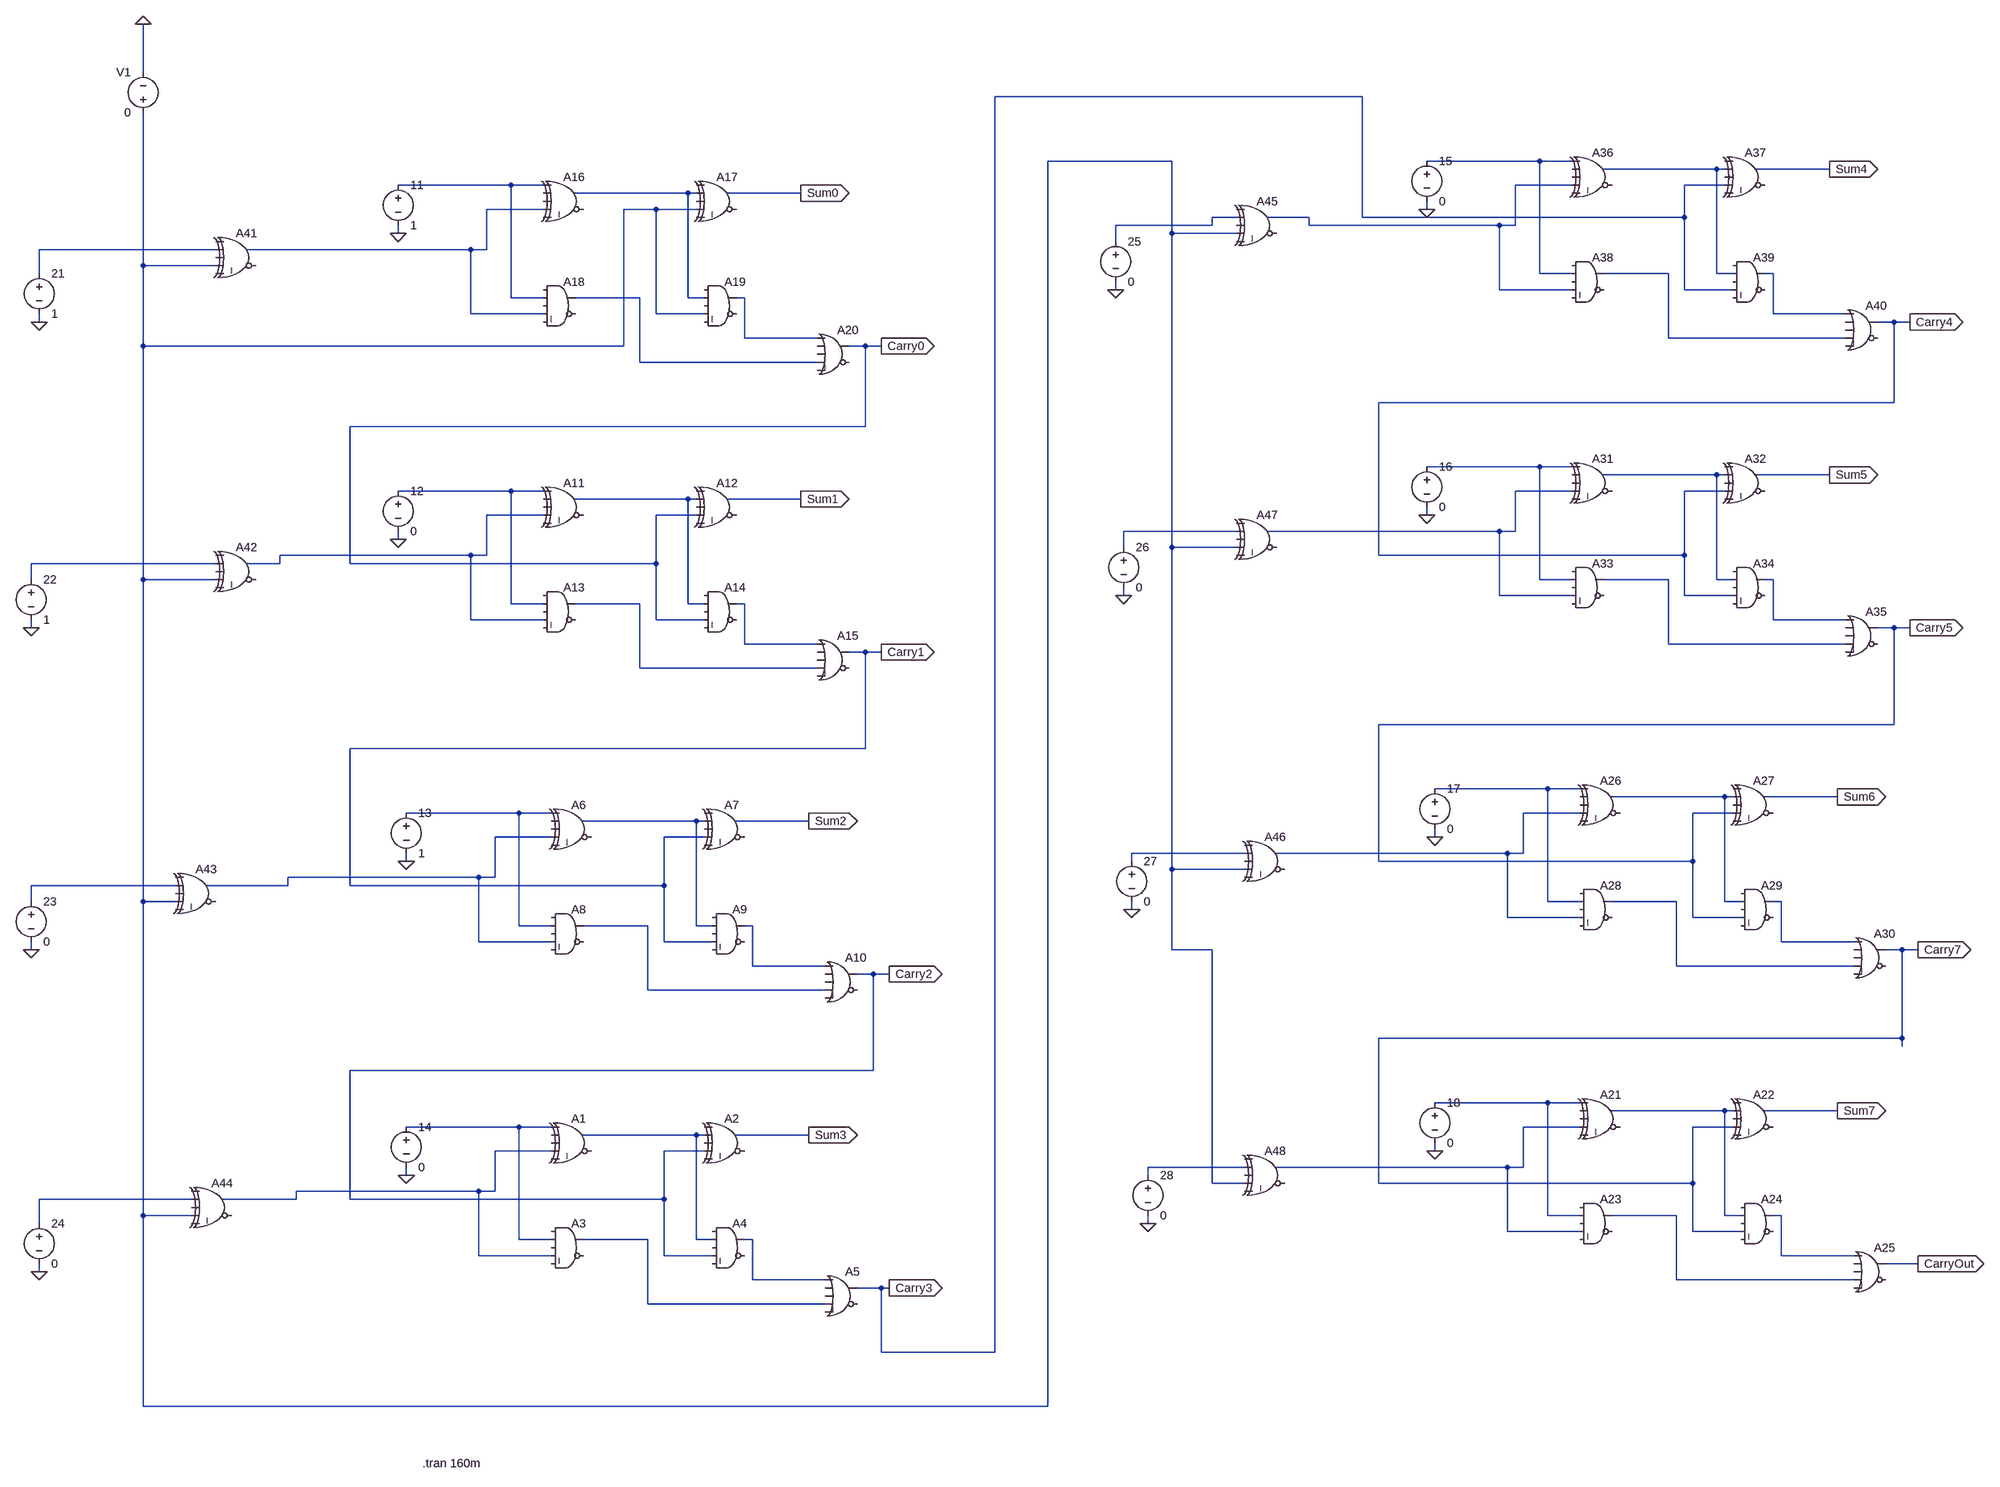
[diagram p0: schematic 8-bit-ADD-SUBRACT.asc]
8-bit-ADD-SUBRACT.asc, the LTspice schematic file:
Version 4.1
SHEET 1 3140 680
WIRE -1056 -2944 -1056 -3040
WIRE 1872 -2896 1072 -2896
WIRE 1472 -2768 1200 -2768
WIRE 2224 -2768 2000 -2768
WIRE 2288 -2768 2224 -2768
WIRE 2576 -2752 2352 -2752
WIRE 2592 -2752 2576 -2752
WIRE 2800 -2752 2656 -2752
WIRE -320 -2720 -544 -2720
WIRE -256 -2720 -320 -2720
WIRE 2288 -2720 2176 -2720
WIRE 2592 -2720 2512 -2720
WIRE 32 -2704 -192 -2704
WIRE 48 -2704 32 -2704
WIRE 256 -2704 112 -2704
WIRE -256 -2672 -368 -2672
WIRE -32 -2672 -96 -2672
WIRE 48 -2672 -32 -2672
WIRE 2000 -2672 2000 -2688
WIRE 1600 -2656 1552 -2656
WIRE 1744 -2656 1664 -2656
WIRE 1872 -2656 1872 -2896
WIRE 2512 -2656 2512 -2720
WIRE 2512 -2656 1872 -2656
WIRE 1552 -2640 1552 -2656
WIRE 1552 -2640 1360 -2640
WIRE 1744 -2640 1744 -2656
WIRE 2144 -2640 1744 -2640
WIRE 2176 -2640 2176 -2720
WIRE 2176 -2640 2144 -2640
WIRE -544 -2624 -544 -2640
WIRE 1472 -2624 1472 -2768
WIRE 1600 -2624 1472 -2624
WIRE 1360 -2608 1360 -2640
WIRE -912 -2592 -1264 -2592
WIRE -400 -2592 -848 -2592
WIRE -368 -2592 -368 -2672
WIRE -368 -2592 -400 -2592
WIRE -1056 -2560 -1056 -2864
WIRE -912 -2560 -1056 -2560
WIRE -1264 -2544 -1264 -2592
WIRE 2224 -2544 2224 -2768
WIRE 2288 -2544 2224 -2544
WIRE 2480 -2544 2352 -2544
WIRE 2576 -2544 2576 -2752
WIRE 2608 -2544 2576 -2544
WIRE 2688 -2544 2672 -2544
WIRE 1360 -2512 1360 -2528
WIRE 2144 -2512 2144 -2640
WIRE 2288 -2512 2144 -2512
WIRE 2512 -2512 2512 -2656
WIRE 2608 -2512 2512 -2512
WIRE -320 -2496 -320 -2720
WIRE -256 -2496 -320 -2496
WIRE -64 -2496 -192 -2496
WIRE 32 -2496 32 -2704
WIRE 64 -2496 32 -2496
WIRE 144 -2496 128 -2496
WIRE -400 -2464 -400 -2592
WIRE -256 -2464 -400 -2464
WIRE -32 -2464 -32 -2672
WIRE 64 -2464 -32 -2464
WIRE 2688 -2464 2688 -2544
WIRE 2832 -2464 2688 -2464
WIRE -1264 -2448 -1264 -2464
WIRE 2928 -2448 2896 -2448
WIRE 2960 -2448 2928 -2448
WIRE 144 -2416 144 -2496
WIRE 288 -2416 144 -2416
WIRE 2480 -2416 2480 -2544
WIRE 2832 -2416 2480 -2416
WIRE -1056 -2400 -1056 -2560
WIRE -96 -2400 -96 -2672
WIRE -96 -2400 -1056 -2400
WIRE 384 -2400 352 -2400
WIRE 416 -2400 384 -2400
WIRE -64 -2368 -64 -2496
WIRE 288 -2368 -64 -2368
WIRE 2928 -2288 2928 -2448
WIRE 2928 -2288 1904 -2288
WIRE 384 -2240 384 -2400
WIRE 384 -2240 -640 -2240
WIRE 2224 -2160 2000 -2160
WIRE 2288 -2160 2224 -2160
WIRE 2576 -2144 2352 -2144
WIRE 2592 -2144 2576 -2144
WIRE 2800 -2144 2656 -2144
WIRE -320 -2112 -544 -2112
WIRE -256 -2112 -320 -2112
WIRE 2288 -2112 2176 -2112
WIRE 2592 -2112 2512 -2112
WIRE 32 -2096 -192 -2096
WIRE 48 -2096 32 -2096
WIRE 256 -2096 112 -2096
WIRE -256 -2064 -368 -2064
WIRE 48 -2064 -32 -2064
WIRE 2000 -2064 2000 -2080
WIRE 1600 -2032 1376 -2032
WIRE 2144 -2032 1664 -2032
WIRE 2176 -2032 2176 -2112
WIRE 2176 -2032 2144 -2032
WIRE -544 -2016 -544 -2032
WIRE 1376 -2000 1376 -2032
WIRE 1472 -2000 1472 -2624
WIRE 1600 -2000 1472 -2000
WIRE -400 -1984 -784 -1984
WIRE -368 -1984 -368 -2064
WIRE -368 -1984 -400 -1984
WIRE 1904 -1984 1904 -2288
WIRE 2512 -1984 2512 -2112
WIRE 2512 -1984 1904 -1984
WIRE -912 -1968 -1280 -1968
WIRE -784 -1968 -784 -1984
WIRE -784 -1968 -848 -1968
WIRE -640 -1968 -640 -2240
WIRE -32 -1968 -32 -2064
WIRE -32 -1968 -640 -1968
WIRE -1280 -1936 -1280 -1968
WIRE -1056 -1936 -1056 -2400
WIRE -912 -1936 -1056 -1936
WIRE 2224 -1936 2224 -2160
WIRE 2288 -1936 2224 -1936
WIRE 2480 -1936 2352 -1936
WIRE 2576 -1936 2576 -2144
WIRE 2608 -1936 2576 -1936
WIRE 2688 -1936 2672 -1936
WIRE 1376 -1904 1376 -1920
WIRE 2144 -1904 2144 -2032
WIRE 2288 -1904 2144 -1904
WIRE 2512 -1904 2512 -1984
WIRE 2608 -1904 2512 -1904
WIRE -320 -1888 -320 -2112
WIRE -256 -1888 -320 -1888
WIRE -64 -1888 -192 -1888
WIRE 32 -1888 32 -2096
WIRE 64 -1888 32 -1888
WIRE 144 -1888 128 -1888
WIRE -400 -1856 -400 -1984
WIRE -256 -1856 -400 -1856
WIRE -32 -1856 -32 -1968
WIRE 64 -1856 -32 -1856
WIRE 2688 -1856 2688 -1936
WIRE 2832 -1856 2688 -1856
WIRE -1280 -1840 -1280 -1856
WIRE 2928 -1840 2896 -1840
WIRE 2960 -1840 2928 -1840
WIRE 144 -1808 144 -1888
WIRE 288 -1808 144 -1808
WIRE 2480 -1808 2480 -1936
WIRE 2832 -1808 2480 -1808
WIRE 384 -1792 352 -1792
WIRE 416 -1792 384 -1792
WIRE -64 -1760 -64 -1888
WIRE 288 -1760 -64 -1760
WIRE 2928 -1648 2928 -1840
WIRE 2928 -1648 1904 -1648
WIRE 384 -1600 384 -1792
WIRE 384 -1600 -640 -1600
WIRE 2240 -1520 2016 -1520
WIRE 2304 -1520 2240 -1520
WIRE 2592 -1504 2368 -1504
WIRE 2608 -1504 2592 -1504
WIRE 2816 -1504 2672 -1504
WIRE -304 -1472 -528 -1472
WIRE -240 -1472 -304 -1472
WIRE 2304 -1472 2192 -1472
WIRE 2608 -1472 2528 -1472
WIRE 48 -1456 -176 -1456
WIRE 64 -1456 48 -1456
WIRE 272 -1456 128 -1456
WIRE -240 -1424 -352 -1424
WIRE 64 -1424 -16 -1424
WIRE 2016 -1424 2016 -1440
WIRE 1616 -1392 1392 -1392
WIRE 2160 -1392 1680 -1392
WIRE 2192 -1392 2192 -1472
WIRE 2192 -1392 2160 -1392
WIRE -528 -1376 -528 -1392
WIRE 1392 -1376 1392 -1392
WIRE 1904 -1376 1904 -1648
WIRE 2528 -1376 2528 -1472
WIRE 2528 -1376 1904 -1376
WIRE 1472 -1360 1472 -2000
WIRE 1616 -1360 1472 -1360
WIRE -384 -1344 -768 -1344
WIRE -352 -1344 -352 -1424
WIRE -352 -1344 -384 -1344
WIRE -992 -1328 -1280 -1328
WIRE -768 -1328 -768 -1344
WIRE -768 -1328 -928 -1328
WIRE -640 -1328 -640 -1600
WIRE -16 -1328 -16 -1424
WIRE -16 -1328 -640 -1328
WIRE -1280 -1296 -1280 -1328
WIRE -1056 -1296 -1056 -1936
WIRE -992 -1296 -1056 -1296
WIRE 2240 -1296 2240 -1520
WIRE 2304 -1296 2240 -1296
WIRE 2496 -1296 2368 -1296
WIRE 2592 -1296 2592 -1504
WIRE 2624 -1296 2592 -1296
WIRE 2704 -1296 2688 -1296
WIRE 1392 -1280 1392 -1296
WIRE 2160 -1264 2160 -1392
WIRE 2304 -1264 2160 -1264
WIRE 2528 -1264 2528 -1376
WIRE 2624 -1264 2528 -1264
WIRE -304 -1248 -304 -1472
WIRE -240 -1248 -304 -1248
WIRE -48 -1248 -176 -1248
WIRE 48 -1248 48 -1456
WIRE 80 -1248 48 -1248
WIRE 160 -1248 144 -1248
WIRE -384 -1216 -384 -1344
WIRE -240 -1216 -384 -1216
WIRE -16 -1216 -16 -1328
WIRE 80 -1216 -16 -1216
WIRE 2704 -1216 2704 -1296
WIRE 2848 -1216 2704 -1216
WIRE -1280 -1200 -1280 -1216
WIRE 1472 -1200 1472 -1360
WIRE 1552 -1200 1472 -1200
WIRE 2944 -1200 2912 -1200
WIRE 2976 -1200 2944 -1200
WIRE 160 -1168 160 -1248
WIRE 304 -1168 160 -1168
WIRE 2496 -1168 2496 -1296
WIRE 2848 -1168 2496 -1168
WIRE 400 -1152 368 -1152
WIRE 432 -1152 400 -1152
WIRE -48 -1120 -48 -1248
WIRE 304 -1120 -48 -1120
WIRE 2944 -1024 2944 -1200
WIRE 2944 -1024 1904 -1024
WIRE 2944 -1008 2944 -1024
WIRE 400 -960 400 -1152
WIRE 400 -960 -640 -960
WIRE 2240 -896 2016 -896
WIRE 2304 -896 2240 -896
WIRE 2592 -880 2368 -880
WIRE 2608 -880 2592 -880
WIRE 2816 -880 2672 -880
WIRE -304 -848 -528 -848
WIRE -240 -848 -304 -848
WIRE 2304 -848 2192 -848
WIRE 2608 -848 2528 -848
WIRE 48 -832 -176 -832
WIRE 64 -832 48 -832
WIRE 272 -832 128 -832
WIRE -240 -800 -352 -800
WIRE 64 -800 -16 -800
WIRE 2016 -800 2016 -816
WIRE 1616 -768 1424 -768
WIRE 2160 -768 1680 -768
WIRE 2192 -768 2192 -848
WIRE 2192 -768 2160 -768
WIRE -528 -752 -528 -768
WIRE 1424 -752 1424 -768
WIRE 1552 -736 1552 -1200
WIRE 1616 -736 1552 -736
WIRE 1904 -736 1904 -1024
WIRE 2528 -736 2528 -848
WIRE 2528 -736 1904 -736
WIRE -384 -720 -752 -720
WIRE -352 -720 -352 -800
WIRE -352 -720 -384 -720
WIRE -960 -704 -1264 -704
WIRE -752 -704 -752 -720
WIRE -752 -704 -896 -704
WIRE -640 -704 -640 -960
WIRE -16 -704 -16 -800
WIRE -16 -704 -640 -704
WIRE -1056 -672 -1056 -1296
WIRE -960 -672 -1056 -672
WIRE 2240 -672 2240 -896
WIRE 2304 -672 2240 -672
WIRE 2496 -672 2368 -672
WIRE 2592 -672 2592 -880
WIRE 2624 -672 2592 -672
WIRE 2704 -672 2688 -672
WIRE -1264 -656 -1264 -704
WIRE 1424 -656 1424 -672
WIRE 2160 -640 2160 -768
WIRE 2304 -640 2160 -640
WIRE 2528 -640 2528 -736
WIRE 2624 -640 2528 -640
WIRE -304 -624 -304 -848
WIRE -240 -624 -304 -624
WIRE -48 -624 -176 -624
WIRE 48 -624 48 -832
WIRE 80 -624 48 -624
WIRE 160 -624 144 -624
WIRE -384 -592 -384 -720
WIRE -240 -592 -384 -592
WIRE -16 -592 -16 -704
WIRE 80 -592 -16 -592
WIRE 2704 -592 2704 -672
WIRE 2848 -592 2704 -592
WIRE 2976 -576 2912 -576
WIRE -1264 -560 -1264 -576
WIRE 160 -544 160 -624
WIRE 304 -544 160 -544
WIRE 2496 -544 2496 -672
WIRE 2848 -544 2496 -544
WIRE 416 -528 368 -528
WIRE 432 -528 416 -528
WIRE -48 -496 -48 -624
WIRE 304 -496 -48 -496
WIRE 416 -400 416 -528
WIRE 1072 -400 1072 -2896
WIRE 1072 -400 416 -400
WIRE -1056 -288 -1056 -672
WIRE 1200 -288 1200 -2768
WIRE 1200 -288 -1056 -288
FLAG -528 -752 0
FLAG -1264 -560 0
FLAG 272 -832 Sum3
IOPIN 272 -832 Out
FLAG 432 -528 Carry3
IOPIN 432 -528 Out
FLAG -528 -1376 0
FLAG -1280 -1200 0
FLAG 272 -1456 Sum2
IOPIN 272 -1456 Out
FLAG 432 -1152 Carry2
IOPIN 432 -1152 Out
FLAG -544 -2016 0
FLAG -1280 -1840 0
FLAG 256 -2096 Sum1
IOPIN 256 -2096 Out
FLAG 416 -1792 Carry1
IOPIN 416 -1792 Out
FLAG -544 -2624 0
FLAG -1264 -2448 0
FLAG 256 -2704 Sum0
IOPIN 256 -2704 Out
FLAG 416 -2400 Carry0
IOPIN 416 -2400 Out
FLAG 2016 -800 0
FLAG 1424 -656 0
FLAG 2816 -880 Sum7
IOPIN 2816 -880 Out
FLAG 2976 -576 CarryOut
IOPIN 2976 -576 Out
FLAG 2016 -1424 0
FLAG 1392 -1280 0
FLAG 2816 -1504 Sum6
IOPIN 2816 -1504 Out
FLAG 2976 -1200 Carry7
IOPIN 2976 -1200 Out
FLAG 2000 -2064 0
FLAG 1376 -1904 0
FLAG 2800 -2144 Sum5
IOPIN 2800 -2144 Out
FLAG 2960 -1840 Carry5
IOPIN 2960 -1840 Out
FLAG 2000 -2672 0
FLAG 1360 -2512 0
FLAG 2800 -2752 Sum4
IOPIN 2800 -2752 Out
FLAG 2960 -2448 Carry4
IOPIN 2960 -2448 Out
FLAG -1056 -3040 0
SYMBOL voltage -528 -864 R0
WINDOW 123 0 0 Left 0
WINDOW 39 0 0 Left 0
SYMATTR InstName 14
SYMATTR Value 0
SYMBOL voltage -1264 -672 R0
WINDOW 123 0 0 Left 0
WINDOW 39 0 0 Left 0
SYMATTR InstName 24
SYMATTR Value 0
SYMBOL Digital\\xor -192 -880 R0
SYMATTR InstName A1
SYMBOL Digital\\xor 112 -880 R0
SYMATTR InstName A2
SYMBOL Digital\\and -208 -672 R0
SYMATTR InstName A3
SYMBOL Digital\\and 112 -672 R0
SYMATTR InstName A4
SYMBOL Digital\\or 336 -576 R0
SYMATTR InstName A5
SYMBOL voltage -528 -1488 R0
WINDOW 123 0 0 Left 0
WINDOW 39 0 0 Left 0
SYMATTR InstName 13
SYMATTR Value 1
SYMBOL voltage -1280 -1312 R0
WINDOW 123 0 0 Left 0
WINDOW 39 0 0 Left 0
SYMATTR InstName 23
SYMATTR Value 0
SYMBOL Digital\\xor -192 -1504 R0
SYMATTR InstName A6
SYMBOL Digital\\xor 112 -1504 R0
SYMATTR InstName A7
SYMBOL Digital\\and -208 -1296 R0
SYMATTR InstName A8
SYMBOL Digital\\and 112 -1296 R0
SYMATTR InstName A9
SYMBOL Digital\\or 336 -1200 R0
SYMATTR InstName A10
SYMBOL voltage -544 -2128 R0
WINDOW 123 0 0 Left 0
WINDOW 39 0 0 Left 0
SYMATTR InstName 12
SYMATTR Value 0
SYMBOL voltage -1280 -1952 R0
WINDOW 123 0 0 Left 0
WINDOW 39 0 0 Left 0
SYMATTR InstName 22
SYMATTR Value 1
SYMBOL Digital\\xor -208 -2144 R0
SYMATTR InstName A11
SYMBOL Digital\\xor 96 -2144 R0
SYMATTR InstName A12
SYMBOL Digital\\and -224 -1936 R0
SYMATTR InstName A13
SYMBOL Digital\\and 96 -1936 R0
SYMATTR InstName A14
SYMBOL Digital\\or 320 -1840 R0
SYMATTR InstName A15
SYMBOL voltage -544 -2736 R0
WINDOW 123 0 0 Left 0
WINDOW 39 0 0 Left 0
SYMATTR InstName 11
SYMATTR Value 1
SYMBOL voltage -1264 -2560 R0
WINDOW 123 0 0 Left 0
WINDOW 39 0 0 Left 0
SYMATTR InstName 21
SYMATTR Value 1
SYMBOL Digital\\xor -208 -2752 R0
SYMATTR InstName A16
SYMBOL Digital\\xor 96 -2752 R0
SYMATTR InstName A17
SYMBOL Digital\\and -224 -2544 R0
SYMATTR InstName A18
SYMBOL Digital\\and 96 -2544 R0
SYMATTR InstName A19
SYMBOL Digital\\or 320 -2448 R0
SYMATTR InstName A20
SYMBOL voltage 2016 -912 R0
WINDOW 123 0 0 Left 0
WINDOW 39 0 0 Left 0
SYMATTR InstName 18
SYMATTR Value 0
SYMBOL voltage 1424 -768 R0
WINDOW 123 0 0 Left 0
WINDOW 39 0 0 Left 0
SYMATTR InstName 28
SYMATTR Value 0
SYMBOL Digital\\xor 2352 -928 R0
SYMATTR InstName A21
SYMBOL Digital\\xor 2656 -928 R0
SYMATTR InstName A22
SYMBOL Digital\\and 2336 -720 R0
SYMATTR InstName A23
SYMBOL Digital\\and 2656 -720 R0
SYMATTR InstName A24
SYMBOL Digital\\or 2880 -624 R0
SYMATTR InstName A25
SYMBOL voltage 2016 -1536 R0
WINDOW 123 0 0 Left 0
WINDOW 39 0 0 Left 0
SYMATTR InstName 17
SYMATTR Value 0
SYMBOL voltage 1392 -1392 R0
WINDOW 123 0 0 Left 0
WINDOW 39 0 0 Left 0
SYMATTR InstName 27
SYMATTR Value 0
SYMBOL Digital\\xor 2352 -1552 R0
SYMATTR InstName A26
SYMBOL Digital\\xor 2656 -1552 R0
SYMATTR InstName A27
SYMBOL Digital\\and 2336 -1344 R0
SYMATTR InstName A28
SYMBOL Digital\\and 2656 -1344 R0
SYMATTR InstName A29
SYMBOL Digital\\or 2880 -1248 R0
SYMATTR InstName A30
SYMBOL voltage 2000 -2176 R0
WINDOW 123 0 0 Left 0
WINDOW 39 0 0 Left 0
SYMATTR InstName 16
SYMATTR Value 0
SYMBOL voltage 1376 -2016 R0
WINDOW 123 0 0 Left 0
WINDOW 39 0 0 Left 0
SYMATTR InstName 26
SYMATTR Value 0
SYMBOL Digital\\xor 2336 -2192 R0
SYMATTR InstName A31
SYMBOL Digital\\xor 2640 -2192 R0
SYMATTR InstName A32
SYMBOL Digital\\and 2320 -1984 R0
SYMATTR InstName A33
SYMBOL Digital\\and 2640 -1984 R0
SYMATTR InstName A34
SYMBOL Digital\\or 2864 -1888 R0
SYMATTR InstName A35
SYMBOL voltage 2000 -2784 R0
WINDOW 123 0 0 Left 0
WINDOW 39 0 0 Left 0
SYMATTR InstName 15
SYMATTR Value 0
SYMBOL voltage 1360 -2624 R0
WINDOW 123 0 0 Left 0
WINDOW 39 0 0 Left 0
SYMATTR InstName 25
SYMATTR Value 0
SYMBOL Digital\\xor 2336 -2800 R0
SYMATTR InstName A36
SYMBOL Digital\\xor 2640 -2800 R0
SYMATTR InstName A37
SYMBOL Digital\\and 2320 -2592 R0
SYMATTR InstName A38
SYMBOL Digital\\and 2640 -2592 R0
SYMATTR InstName A39
SYMBOL Digital\\or 2864 -2496 R0
SYMATTR InstName A40
SYMBOL Digital\\xor -864 -2640 R0
SYMATTR InstName A41
SYMBOL Digital\\xor -864 -2016 R0
SYMATTR InstName A42
SYMBOL Digital\\xor -944 -1376 R0
SYMATTR InstName A43
SYMBOL Digital\\xor -912 -752 R0
SYMATTR InstName A44
SYMBOL Digital\\xor 1648 -2704 R0
SYMATTR InstName A45
SYMBOL voltage -1056 -2848 R180
WINDOW 0 24 96 Left 2
WINDOW 3 24 16 Left 2
WINDOW 123 0 0 Left 0
WINDOW 39 0 0 Left 0
SYMATTR InstName V1
SYMATTR Value 0
SYMBOL Digital\\xor 1648 -2080 R0
SYMATTR InstName A47
SYMBOL Digital\\xor 1664 -816 R0
SYMATTR InstName A48
SYMBOL Digital\\xor 1664 -1440 R0
SYMATTR InstName A46
TEXT -496 -8 Left 2 !.tran 160m

The netlist it stands for:
* 8-bit-ADD-SUBRACT.asc
V§14 N040 0 0
V§24 N045 0 0
A1 N040 0 0 N043 0 0 N042 0 XOR
A2 0 N042 0 Carry2 0 0 Sum3 0 XOR
A3 0 N040 0 N043 0 0 N048 0 AND
A4 0 N042 0 Carry2 0 0 N049 0 AND
A5 N049 0 0 N048 0 0 Carry3 0 OR
V§13 N028 0 1
V§23 N033 0 0
A6 N028 0 0 N031 0 0 N030 0 XOR
A7 0 N030 0 Carry1 0 0 Sum2 0 XOR
A8 0 N028 0 N031 0 0 N036 0 AND
A9 0 N030 0 Carry1 0 0 N037 0 AND
A10 N037 0 0 N036 0 0 Carry2 0 OR
V§12 N016 0 0
V§22 N021 0 1
A11 N016 0 0 N019 0 0 N018 0 XOR
A12 0 N018 0 Carry0 0 0 Sum1 0 XOR
A13 0 N016 0 N019 0 0 N024 0 AND
A14 0 N018 0 Carry0 0 0 N025 0 AND
A15 N025 0 0 N024 0 0 Carry1 0 OR
V§11 N004 0 1
V§21 N009 0 1
A16 N004 0 0 N007 0 0 N006 0 XOR
A17 0 N006 0 N001 0 0 Sum0 0 XOR
A18 0 N004 0 N007 0 0 N012 0 AND
A19 0 N006 0 N001 0 0 N013 0 AND
A20 N013 0 0 N012 0 0 Carry0 0 OR
V§18 N038 0 0
V§28 N044 0 0
A21 N038 0 0 N041 0 0 N039 0 XOR
A22 0 N039 0 Carry7 0 0 Sum7 0 XOR
A23 0 N038 0 N041 0 0 N046 0 AND
A24 0 N039 0 Carry7 0 0 N047 0 AND
A25 N047 0 0 N046 0 0 CarryOut 0 OR
V§17 N026 0 0
V§27 N032 0 0
A26 N026 0 0 N029 0 0 N027 0 XOR
A27 0 N027 0 Carry5 0 0 Sum6 0 XOR
A28 0 N026 0 N029 0 0 N034 0 AND
A29 0 N027 0 Carry5 0 0 N035 0 AND
A30 N035 0 0 N034 0 0 Carry7 0 OR
V§16 N014 0 0
V§26 N020 0 0
A31 N014 0 0 N017 0 0 N015 0 XOR
A32 0 N015 0 Carry4 0 0 Sum5 0 XOR
A33 0 N014 0 N017 0 0 N022 0 AND
A34 0 N015 0 Carry4 0 0 N023 0 AND
A35 N023 0 0 N022 0 0 Carry5 0 OR
V§15 N002 0 0
V§25 N008 0 0
A36 N002 0 0 N005 0 0 N003 0 XOR
A37 0 N003 0 Carry3 0 0 Sum4 0 XOR
A38 0 N002 0 N005 0 0 N010 0 AND
A39 0 N003 0 Carry3 0 0 N011 0 AND
A40 N011 0 0 N010 0 0 Carry4 0 OR
A41 0 N009 0 N001 0 0 N007 0 XOR
A42 0 N021 0 N001 0 0 N019 0 XOR
A43 0 N033 0 N001 0 0 N031 0 XOR
A44 0 N045 0 N001 0 0 N043 0 XOR
A45 0 N008 0 N001 0 0 N005 0 XOR
V1 N001 0 0
A47 0 N020 0 N001 0 0 N017 0 XOR
A48 0 N044 0 N001 0 0 N041 0 XOR
A46 0 N032 0 N001 0 0 N029 0 XOR
.tran 160m
.backanno
.end